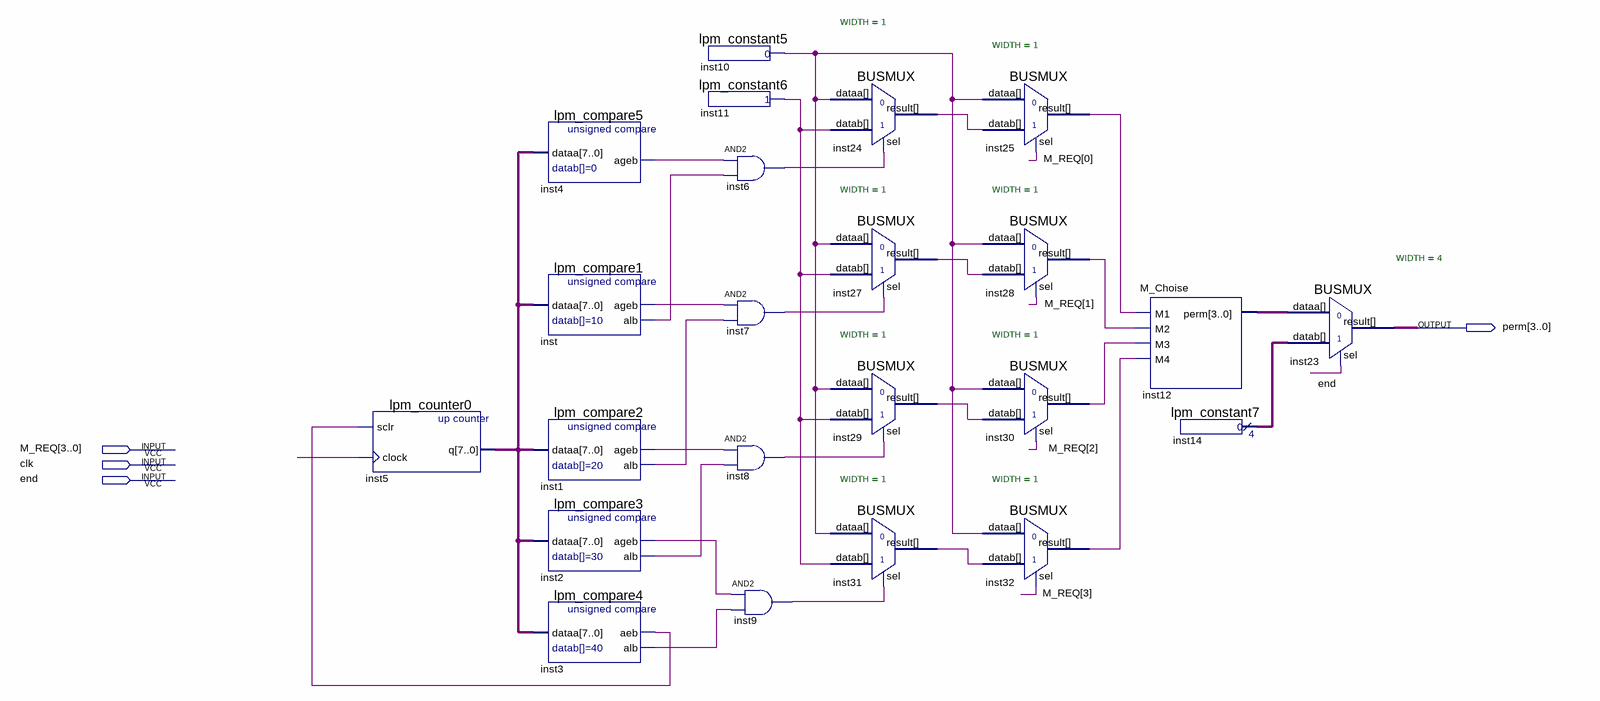
[diagram p0: schematic sheet]
// Quartus schematic Block10.bdf as structural Verilog: 23 symbols, 4 pins
module Block10 (
  input  [3:0] M_REQ,
  input  clk,
  input  \end ,
  output [3:0] perm
);

  wire inst1_ageb, inst1_alb, inst2_ageb, inst2_alb, inst3_aeb, inst3_alb, inst4_ageb, inst6_out, inst7_out,
       inst8_out, inst9_out, inst10_result, inst11_result, inst24_result, inst25_result, inst27_result,
       inst28_result, inst29_result, inst30_result, inst31_result, inst32_result, inst_ageb, inst_alb,
       undriven;
  wire [3:0] inst12_perm, inst14_result;
  wire [7:0] inst5_q;

  lpm_counter0 inst5 (.sclr(inst3_aeb), .clock(undriven), .q(inst5_q));
  lpm_compare5 inst4 (.dataa(inst5_q), .ageb(inst4_ageb));
  lpm_compare1 inst (.dataa(inst5_q), .ageb(inst_ageb), .alb(inst_alb));
  lpm_compare2 inst1 (.dataa(inst5_q), .ageb(inst1_ageb), .alb(inst1_alb));
  lpm_compare3 inst2 (.dataa(inst5_q), .ageb(inst2_ageb), .alb(inst2_alb));
  lpm_compare4 inst3 (.dataa(inst5_q), .aeb(inst3_aeb), .alb(inst3_alb));
  lpm_constant5 inst10 (.result(inst10_result));
  lpm_constant6 inst11 (.result(inst11_result));
  and inst6 (inst6_out, inst4_ageb, inst_alb);
  and inst7 (inst7_out, inst_ageb, inst1_alb);
  and inst8 (inst8_out, inst1_ageb, inst2_alb);
  and inst9 (inst9_out, inst2_ageb, inst3_alb);
  BUSMUX #(.WIDTH(1)) inst24 (.datab(inst11_result), .sel(inst6_out), .dataa(inst10_result), .result(inst24_result));
  BUSMUX #(.WIDTH(1)) inst27 (.datab(inst11_result), .sel(inst7_out), .dataa(inst10_result), .result(inst27_result));
  BUSMUX #(.WIDTH(1)) inst29 (.datab(inst11_result), .sel(inst8_out), .dataa(inst10_result), .result(inst29_result));
  BUSMUX #(.WIDTH(1)) inst31 (.datab(inst11_result), .sel(inst9_out), .dataa(inst10_result), .result(inst31_result));
  BUSMUX #(.WIDTH(1)) inst25 (.datab(inst24_result), .sel(M_REQ[0]), .dataa(inst10_result), .result(inst25_result));
  BUSMUX #(.WIDTH(1)) inst28 (.datab(inst27_result), .sel(M_REQ[1]), .dataa(inst10_result), .result(inst28_result));
  BUSMUX #(.WIDTH(1)) inst30 (.datab(inst29_result), .sel(M_REQ[2]), .dataa(inst10_result), .result(inst30_result));
  BUSMUX #(.WIDTH(1)) inst32 (.datab(inst31_result), .sel(M_REQ[3]), .dataa(inst10_result), .result(inst32_result));
  M_Choise inst12 (.M1(inst25_result), .M2(inst28_result), .M3(inst30_result), .M4(inst32_result), .perm(inst12_perm));
  lpm_constant7 inst14 (.result(inst14_result));
  BUSMUX #(.WIDTH(4)) inst23 (.datab(inst14_result), .sel(\end ), .dataa(inst12_perm), .result(perm));
endmodule
